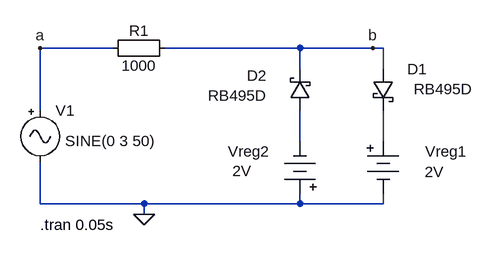
[diagram p0: schematic LD-B-VAR.asc]
LD-B-VAR.asc, the LTspice schematic file:
Version 4
SHEET 1 880 680
WIRE 0 96 -112 96
WIRE 288 96 80 96
WIRE 400 96 288 96
WIRE 416 96 400 96
WIRE 288 128 288 96
WIRE 416 128 416 96
WIRE -112 192 -112 96
WIRE 288 240 288 192
WIRE 416 240 416 192
WIRE -112 336 -112 272
WIRE 48 336 -112 336
WIRE 288 336 288 320
WIRE 288 336 48 336
WIRE 416 336 416 320
WIRE 416 336 288 336
WIRE 48 352 48 336
FLAG -112 96 a
FLAG 400 96 b
FLAG 48 352 0
SYMBOL schottky 400 128 R0
WINDOW 3 63 31 Left 2
WINDOW 0 53 0 Left 2
SYMATTR Value RB495D
SYMATTR InstName D1
SYMATTR Description Diode
SYMATTR Type diode
SYMBOL Misc\\signal -112 176 R0
WINDOW 123 0 0 Left 2
WINDOW 39 0 0 Left 2
WINDOW 3 38 63 Left 2
SYMATTR Value SINE(0 3 50)
SYMATTR InstName V1
SYMBOL Misc\\EuropeanResistor 96 80 R90
WINDOW 0 5 56 VBottom 2
WINDOW 3 27 56 VTop 2
SYMATTR InstName R1
SYMATTR Value 1000
SYMBOL Misc\\battery 416 224 R0
WINDOW 3 64 63 Left 2
WINDOW 0 65 31 Left 2
SYMATTR Value 2V
SYMATTR InstName Vreg1
SYMBOL schottky 304 192 R180
WINDOW 3 67 23 Left 2
WINDOW 0 67 54 Left 2
SYMATTR Value RB495D
SYMATTR InstName D2
SYMATTR Description Diode
SYMATTR Type diode
SYMBOL Misc\\battery 288 336 R180
WINDOW 3 75 51 Left 2
WINDOW 0 46 81 Left 2
SYMATTR Value 2V
SYMATTR InstName Vreg2
TEXT -112 368 Left 2 !.tran 0.05s

The netlist it stands for:
* LD-B-VAR.asc
D1 b N002 RB495D
V1 a 0 SINE(0 3 50)
R1 b a 1000
Vreg1 N002 0 2V
D2 N001 b RB495D
Vreg2 0 N001 2V
.model D D
.lib standard.dio
.tran 0.05s
.backanno
.end